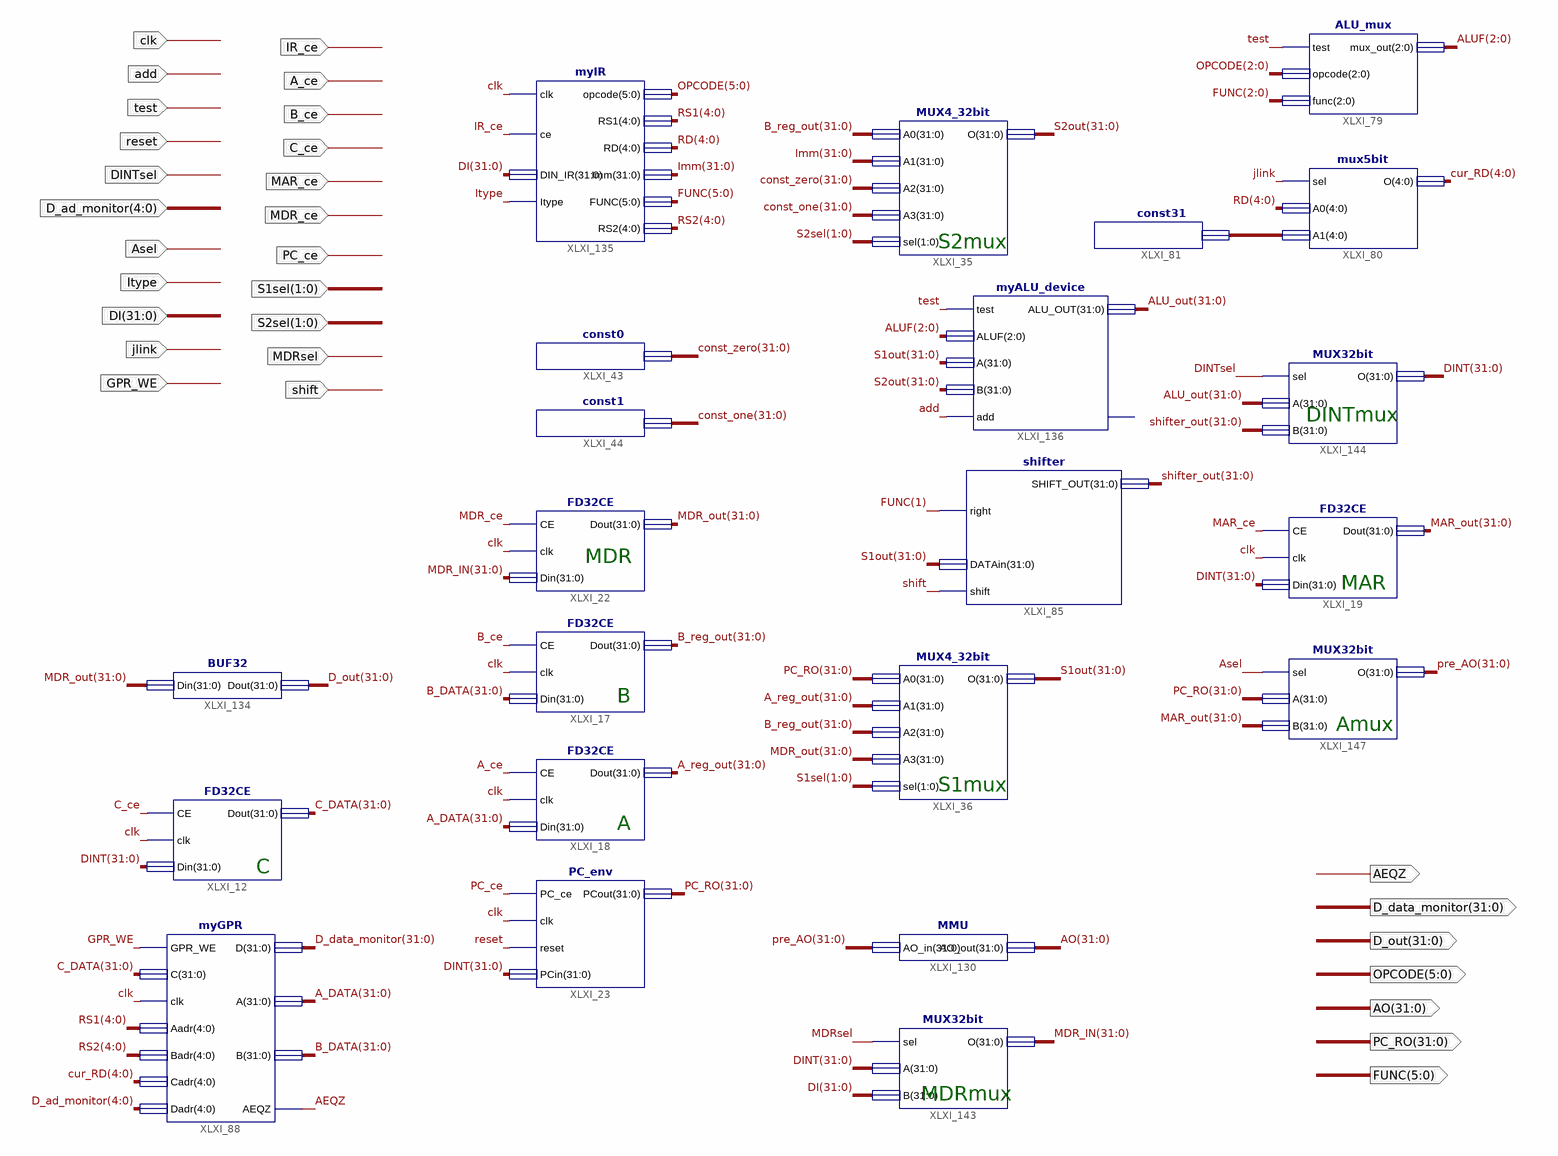
[diagram p0: schematic sheet 1]
// Xilinx ISE schematic Data.sch (spartan3) as structural Verilog: 22 symbols, 29 ports
module Data (
  input  A_ce,
  input  B_ce,
  input  C_ce,
  input  MAR_ce,
  input  MDR_ce,
  input  PC_ce,
  input  clk,
  input  reset,
  input  add,
  input  test,
  input  DINTsel,
  input  [4:0] D_ad_monitor,
  input  Asel,
  input  Itype,
  input  [31:0] DI,
  input  jlink,
  input  GPR_WE,
  input  IR_ce,
  input  [1:0] S1sel,
  input  [1:0] S2sel,
  input  shift,
  input  MDRsel,
  output AEQZ,
  output [31:0] D_data_monitor,
  output [31:0] D_out,
  output [5:0] OPCODE,
  output [31:0] AO,
  output [31:0] PC_RO,
  output [5:0] FUNC
);

  wire [2:0] ALUF;
  wire [4:0] cur_RD, RD, RS1, RS2, XLXN_444;
  wire [31:0] A_DATA, A_reg_out, ALU_out, B_DATA, B_reg_out, C_DATA, const_one, const_zero, DINT, Imm,
       MAR_out, MDR_IN, MDR_out, pre_AO, S1out, S2out, shifter_out;

  mux5bit XLXI_80 (.sel(jlink), .A0(RD), .A1(XLXN_444), .O(cur_RD));
  const31 XLXI_81 (.Cout31(XLXN_444));
  FD32CE XLXI_22 (.CE(MDR_ce), .clk(clk), .Din(MDR_IN), .Dout(MDR_out));
  FD32CE XLXI_17 (.CE(B_ce), .clk(clk), .Din(B_DATA), .Dout(B_reg_out));
  FD32CE XLXI_18 (.CE(A_ce), .clk(clk), .Din(A_DATA), .Dout(A_reg_out));
  PC_env XLXI_23 (.PC_ce(PC_ce), .clk(clk), .reset(reset), .PCin(DINT), .PCout(PC_RO));
  const1 XLXI_44 (.c_out(const_one));
  const0 XLXI_43 (.c_out(const_zero));
  MUX4_32bit XLXI_36 (.A0(PC_RO), .A1(A_reg_out), .A2(B_reg_out), .A3(MDR_out), .sel(S1sel), .O(S1out));
  MUX4_32bit XLXI_35 (.A0(B_reg_out), .A1(Imm), .A2(const_zero), .A3(const_one), .sel(S2sel), .O(S2out));
  shifter XLXI_85 (.right(FUNC[1]), .SHIFT_OUT(shifter_out), .DATAin(S1out), .shift(shift));
  FD32CE XLXI_19 (.CE(MAR_ce), .clk(clk), .Din(DINT), .Dout(MAR_out));
  myGPR XLXI_88 (
    .GPR_WE(GPR_WE), .C(C_DATA), .clk(clk), .Aadr(RS1), .Badr(RS2), .Cadr(cur_RD), .Dadr(D_ad_monitor),
    .D(D_data_monitor), .A(A_DATA), .B(B_DATA), .AEQZ(AEQZ));
  FD32CE XLXI_12 (.CE(C_ce), .clk(clk), .Din(DINT), .Dout(C_DATA));
  ALU_mux XLXI_79 (.test(test), .opcode(OPCODE[2:0]), .func(FUNC[2:0]), .mux_out(ALUF));
  MMU XLXI_130 (.AO_in(pre_AO), .AO_out(AO));
  BUF32 XLXI_134 (.Din(MDR_out), .Dout(D_out));
  myIR XLXI_135 (
    .clk(clk), .ce(IR_ce), .DIN_IR(DI), .Itype(Itype), .RS1(RS1), .opcode(OPCODE), .FUNC(FUNC), .RS2(RS2),
    .RD(RD), .Imm(Imm));
  myALU_device XLXI_136 (
    .test(test), .ALUF(ALUF), .A(S1out), .B(S2out), .add(add), .ALU_OUT(ALU_out));  // open: ALU_OVF
  MUX32bit XLXI_143 (.sel(MDRsel), .A(DINT), .B(DI), .O(MDR_IN));
  MUX32bit XLXI_147 (.sel(Asel), .A(PC_RO), .B(MAR_out), .O(pre_AO));
  MUX32bit XLXI_144 (.sel(DINTsel), .A(ALU_out), .B(shifter_out), .O(DINT));

  // Notes on the sheet:
  //   S2mux
  //   DINTmux
  //   MDR
  //   MAR
  //   B
  //   Amux
  //   S1mux
  //   A
  //   C
  //   MDRmux
endmodule
